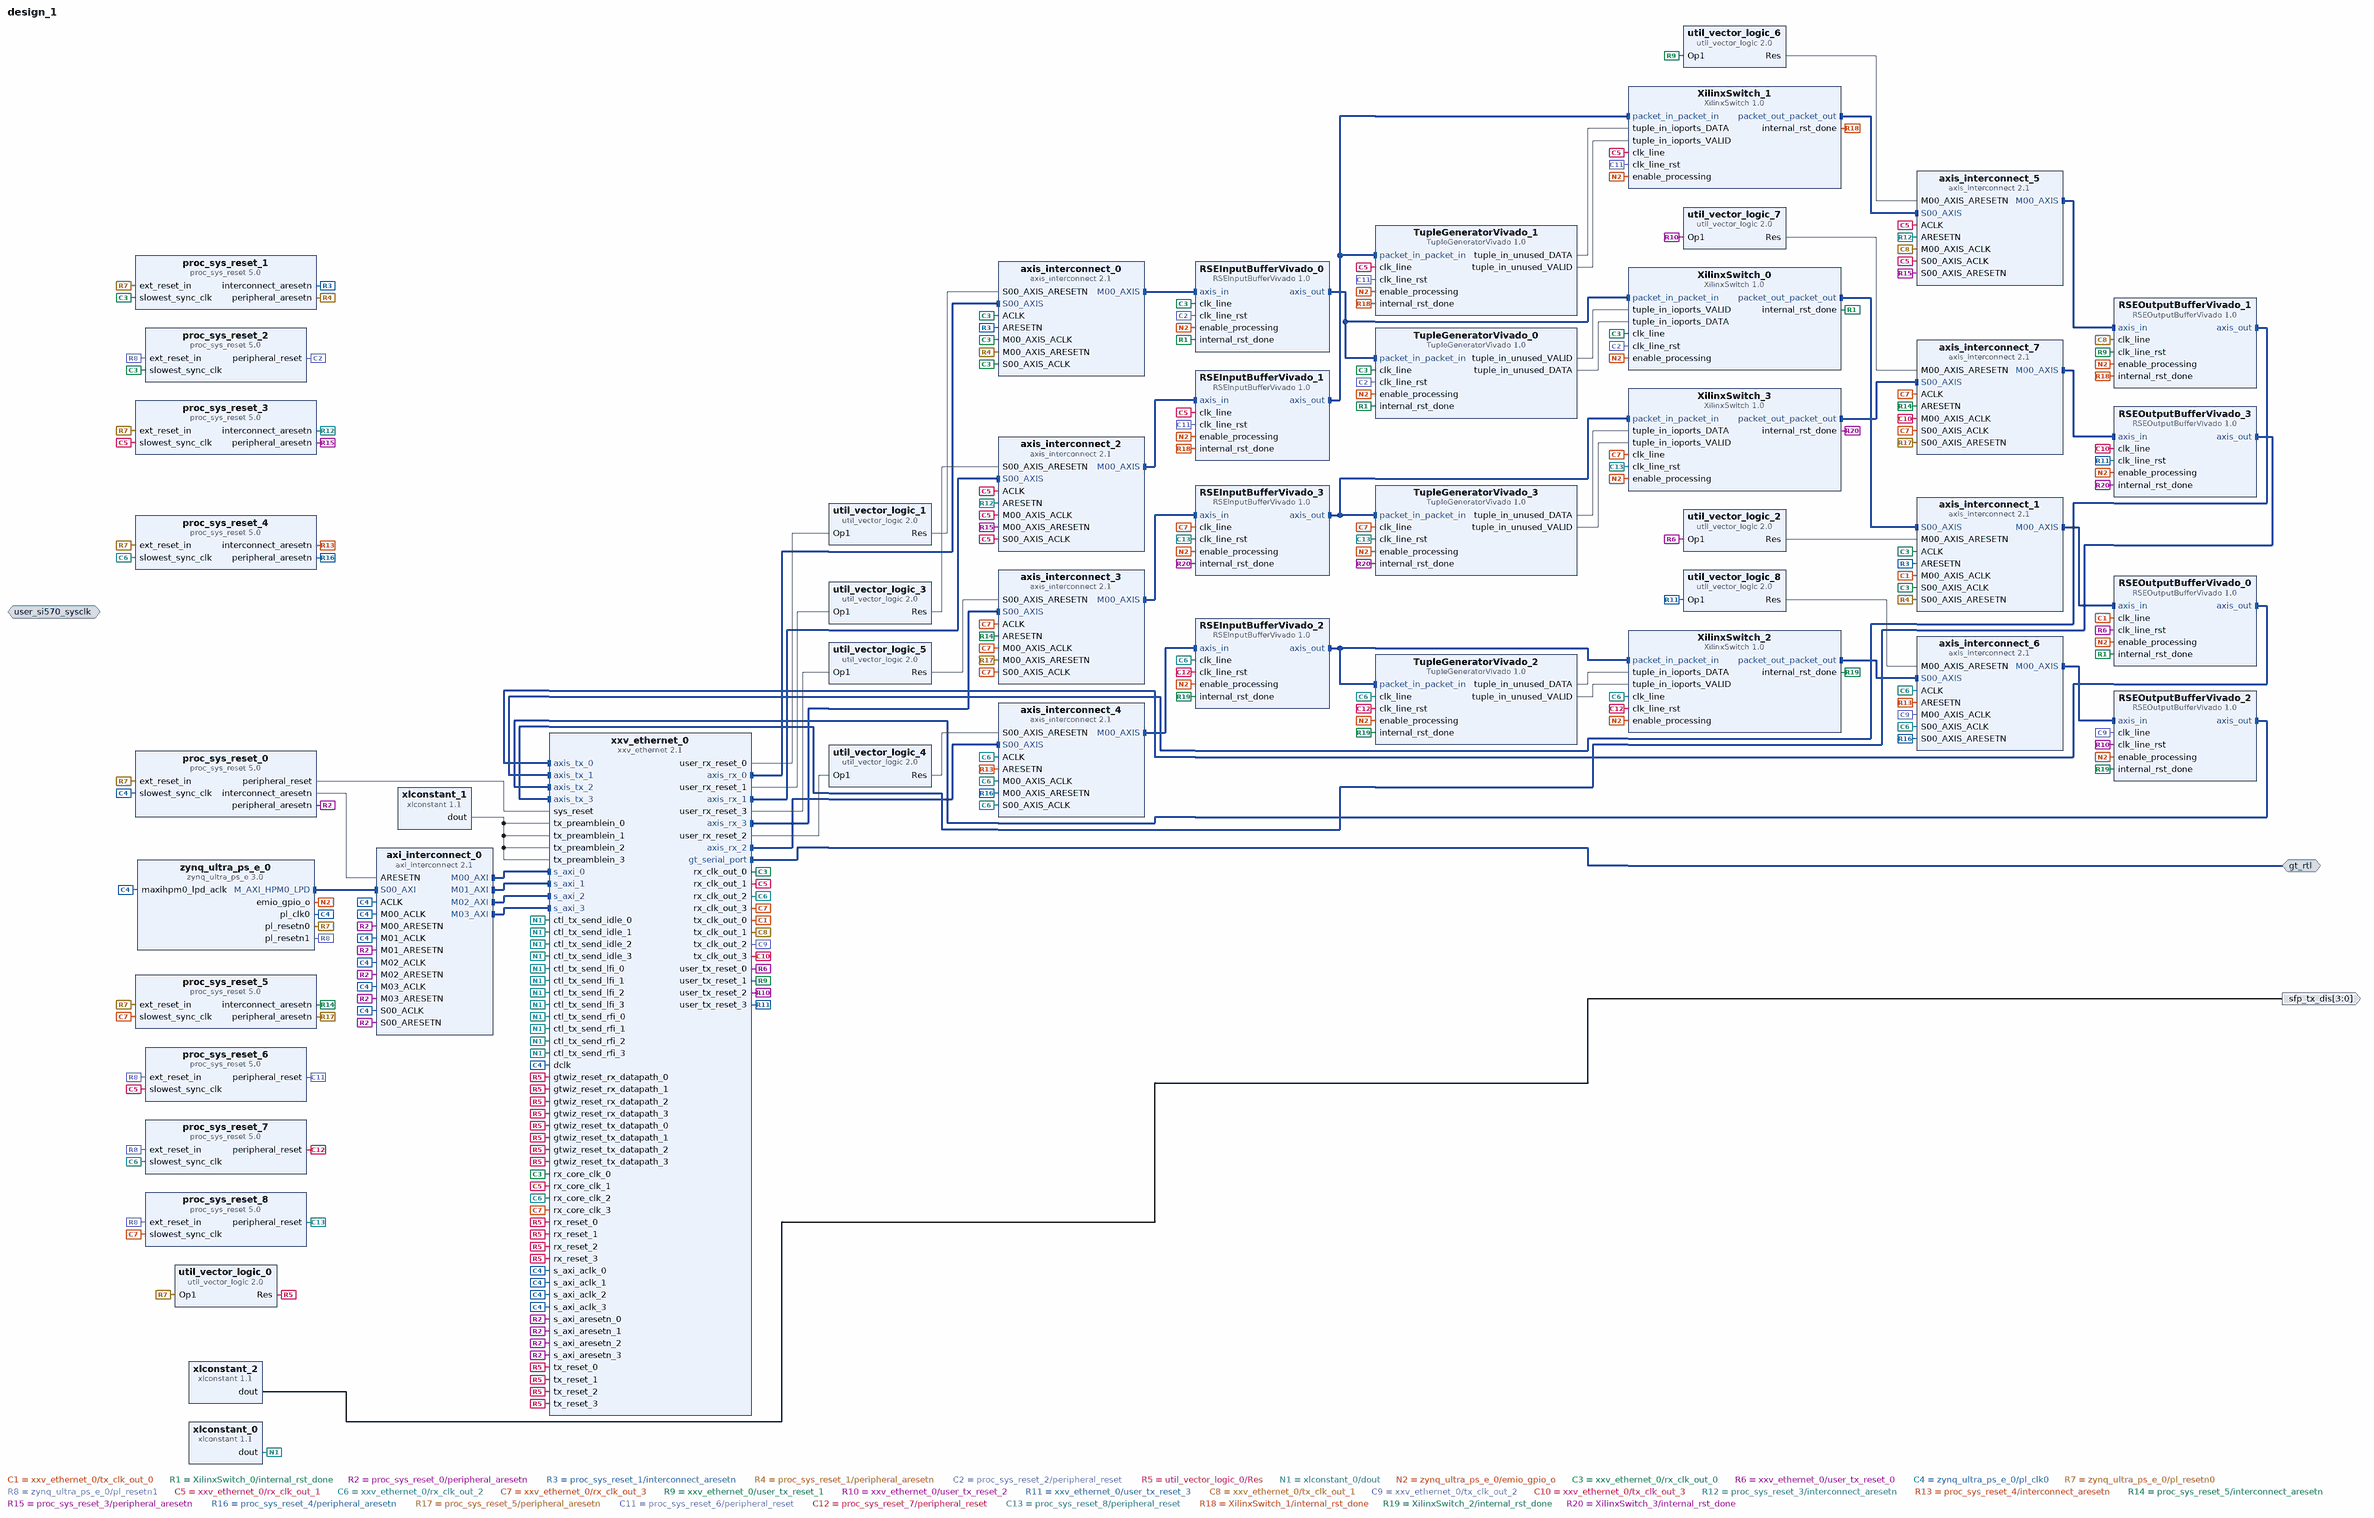
[diagram p0: block diagram of the top level]
# Vivado block design design_1, xczu9eg-ffvb1156-2-i, Vivado 2017.1_sdx
create_bd_design design_1

create_bd_intf_port -mode Master -vlnv xilinx.com:interface:gt_rtl:1.0 gt_rtl
create_bd_intf_port -mode Slave -vlnv xilinx.com:interface:diff_clock_rtl:1.0 user_si570_sysclk
set_property -dict {CONFIG.FREQ_HZ 156250000} [get_bd_intf_ports user_si570_sysclk]
create_bd_port -dir O -from 3 -to 0 sfp_tx_dis

create_bd_cell -type ip -vlnv xilinx.com:ip:axi_interconnect:2.1 axi_interconnect_0
set_property -dict {CONFIG.NUM_MI 4} [get_bd_cells axi_interconnect_0]
create_bd_cell -type ip -vlnv xilinx.com:ip:axis_interconnect:2.1 axis_interconnect_0
set_property -dict {CONFIG.NUM_MI 1} [get_bd_cells axis_interconnect_0]
create_bd_cell -type ip -vlnv xilinx.com:ip:axis_interconnect:2.1 axis_interconnect_1
set_property -dict {CONFIG.NUM_MI 1} [get_bd_cells axis_interconnect_1]
create_bd_cell -type ip -vlnv xilinx.com:ip:proc_sys_reset:5.0 proc_sys_reset_0
create_bd_cell -type ip -vlnv xilinx.com:ip:proc_sys_reset:5.0 proc_sys_reset_1
create_bd_cell -type ip -vlnv xilinx.com:ip:proc_sys_reset:5.0 proc_sys_reset_2
create_bd_cell -type ip -vlnv xilinx.com:ip:util_vector_logic:2.0 util_vector_logic_0
set_property -dict {CONFIG.C_SIZE 1 CONFIG.C_OPERATION not} [get_bd_cells util_vector_logic_0]
create_bd_cell -type ip -vlnv xilinx.com:ip:util_vector_logic:2.0 util_vector_logic_1
set_property -dict {CONFIG.C_SIZE 1 CONFIG.C_OPERATION not} [get_bd_cells util_vector_logic_1]
create_bd_cell -type ip -vlnv xilinx.com:ip:util_vector_logic:2.0 util_vector_logic_2
set_property -dict {CONFIG.C_SIZE 1 CONFIG.C_OPERATION not} [get_bd_cells util_vector_logic_2]
create_bd_cell -type ip -vlnv xilinx.com:ip:xlconstant:1.1 xlconstant_0
set_property -dict {CONFIG.CONST_WIDTH 1 CONFIG.CONST_VAL 0} [get_bd_cells xlconstant_0]
create_bd_cell -type ip -vlnv xilinx.com:ip:xlconstant:1.1 xlconstant_1
set_property -dict {CONFIG.CONST_WIDTH 56 CONFIG.CONST_VAL 0} [get_bd_cells xlconstant_1]
create_bd_cell -type ip -vlnv xilinx.com:ip:xlconstant:1.1 xlconstant_2
set_property -dict {CONFIG.CONST_WIDTH 4 CONFIG.CONST_VAL 0} [get_bd_cells xlconstant_2]
create_bd_cell -type ip -vlnv xilinx.com:ip:xxv_ethernet:2.1 xxv_ethernet_0
set_property -dict [list \
  CONFIG.NUM_OF_CORES 4 \
  CONFIG.BASE_R_KR BASE-R \
  CONFIG.GT_GROUP_SELECT Quad_X1Y3 \
  CONFIG.LANE1_GT_LOC X1Y12 \
  CONFIG.LANE2_GT_LOC X1Y13 \
  CONFIG.LANE3_GT_LOC X1Y14 \
  CONFIG.LANE4_GT_LOC X1Y15 \
  CONFIG.USE_BOARD_FLOW true \
  CONFIG.DIFFCLK_BOARD_INTERFACE user_si570_sysclk \
] [get_bd_cells xxv_ethernet_0]
create_bd_cell -type ip -vlnv xilinx.com:ip:zynq_ultra_ps_e:3.0 zynq_ultra_ps_e_0
set_property -dict [list \
  CONFIG.PSU__FPGA_PL1_ENABLE 1 \
  CONFIG.PSU__GPIO_EMIO__PERIPHERAL__ENABLE 1 \
  CONFIG.PSU__GPIO_EMIO__PERIPHERAL__IO 1 \
  CONFIG.PSU__PMU__PERIPHERAL__ENABLE 0 \
  CONFIG.PSU__CRL_APB__PL0_REF_CTRL__SRCSEL IOPLL \
  CONFIG.PSU__CRL_APB__PL1_REF_CTRL__SRCSEL IOPLL \
  CONFIG.PSU__CRL_APB__PL1_REF_CTRL__FREQMHZ 300 \
  CONFIG.PSU__NUM_FABRIC_RESETS 2 \
] [get_bd_cells zynq_ultra_ps_e_0]
create_bd_cell -type ip -vlnv upenn.edu:user:RSEInputBufferVivado:1.0 RSEInputBufferVivado_0
create_bd_cell -type ip -vlnv upenn.edu:user:TupleGeneratorVivado:1.0 TupleGeneratorVivado_0
create_bd_cell -type ip -vlnv upenn.edu:user:RSEOutputBufferVivado:1.0 RSEOutputBufferVivado_0
create_bd_cell -type ip -vlnv xilinx.com:sdnet:XilinxSwitch:1.0 XilinxSwitch_0
create_bd_cell -type ip -vlnv upenn.edu:user:RSEOutputBufferVivado:1.0 RSEOutputBufferVivado_1
create_bd_cell -type ip -vlnv upenn.edu:user:RSEOutputBufferVivado:1.0 RSEOutputBufferVivado_2
create_bd_cell -type ip -vlnv upenn.edu:user:RSEOutputBufferVivado:1.0 RSEOutputBufferVivado_3
create_bd_cell -type ip -vlnv xilinx.com:ip:util_vector_logic:2.0 util_vector_logic_3
set_property -dict {CONFIG.C_SIZE 1 CONFIG.C_OPERATION not} [get_bd_cells util_vector_logic_3]
create_bd_cell -type ip -vlnv xilinx.com:ip:util_vector_logic:2.0 util_vector_logic_4
set_property -dict {CONFIG.C_SIZE 1 CONFIG.C_OPERATION not} [get_bd_cells util_vector_logic_4]
create_bd_cell -type ip -vlnv xilinx.com:ip:util_vector_logic:2.0 util_vector_logic_5
set_property -dict {CONFIG.C_SIZE 1 CONFIG.C_OPERATION not} [get_bd_cells util_vector_logic_5]
create_bd_cell -type ip -vlnv xilinx.com:ip:axis_interconnect:2.1 axis_interconnect_2
set_property -dict {CONFIG.NUM_MI 1} [get_bd_cells axis_interconnect_2]
create_bd_cell -type ip -vlnv xilinx.com:ip:axis_interconnect:2.1 axis_interconnect_3
set_property -dict {CONFIG.NUM_MI 1} [get_bd_cells axis_interconnect_3]
create_bd_cell -type ip -vlnv xilinx.com:ip:axis_interconnect:2.1 axis_interconnect_4
set_property -dict {CONFIG.NUM_MI 1} [get_bd_cells axis_interconnect_4]
create_bd_cell -type ip -vlnv upenn.edu:user:RSEInputBufferVivado:1.0 RSEInputBufferVivado_1
create_bd_cell -type ip -vlnv upenn.edu:user:RSEInputBufferVivado:1.0 RSEInputBufferVivado_2
create_bd_cell -type ip -vlnv upenn.edu:user:RSEInputBufferVivado:1.0 RSEInputBufferVivado_3
create_bd_cell -type ip -vlnv upenn.edu:user:TupleGeneratorVivado:1.0 TupleGeneratorVivado_1
create_bd_cell -type ip -vlnv upenn.edu:user:TupleGeneratorVivado:1.0 TupleGeneratorVivado_2
create_bd_cell -type ip -vlnv upenn.edu:user:TupleGeneratorVivado:1.0 TupleGeneratorVivado_3
create_bd_cell -type ip -vlnv xilinx.com:sdnet:XilinxSwitch:1.0 XilinxSwitch_1
create_bd_cell -type ip -vlnv xilinx.com:sdnet:XilinxSwitch:1.0 XilinxSwitch_2
create_bd_cell -type ip -vlnv xilinx.com:sdnet:XilinxSwitch:1.0 XilinxSwitch_3
create_bd_cell -type ip -vlnv xilinx.com:ip:axis_interconnect:2.1 axis_interconnect_5
set_property -dict {CONFIG.NUM_MI 1} [get_bd_cells axis_interconnect_5]
create_bd_cell -type ip -vlnv xilinx.com:ip:axis_interconnect:2.1 axis_interconnect_6
set_property -dict {CONFIG.NUM_MI 1} [get_bd_cells axis_interconnect_6]
create_bd_cell -type ip -vlnv xilinx.com:ip:axis_interconnect:2.1 axis_interconnect_7
set_property -dict {CONFIG.NUM_MI 1} [get_bd_cells axis_interconnect_7]
create_bd_cell -type ip -vlnv xilinx.com:ip:proc_sys_reset:5.0 proc_sys_reset_3
create_bd_cell -type ip -vlnv xilinx.com:ip:proc_sys_reset:5.0 proc_sys_reset_4
create_bd_cell -type ip -vlnv xilinx.com:ip:proc_sys_reset:5.0 proc_sys_reset_5
create_bd_cell -type ip -vlnv xilinx.com:ip:proc_sys_reset:5.0 proc_sys_reset_6
create_bd_cell -type ip -vlnv xilinx.com:ip:proc_sys_reset:5.0 proc_sys_reset_7
create_bd_cell -type ip -vlnv xilinx.com:ip:proc_sys_reset:5.0 proc_sys_reset_8
create_bd_cell -type ip -vlnv xilinx.com:ip:util_vector_logic:2.0 util_vector_logic_6
set_property -dict {CONFIG.C_SIZE 1 CONFIG.C_OPERATION not} [get_bd_cells util_vector_logic_6]
create_bd_cell -type ip -vlnv xilinx.com:ip:util_vector_logic:2.0 util_vector_logic_7
set_property -dict {CONFIG.C_SIZE 1 CONFIG.C_OPERATION not} [get_bd_cells util_vector_logic_7]
create_bd_cell -type ip -vlnv xilinx.com:ip:util_vector_logic:2.0 util_vector_logic_8
set_property -dict {CONFIG.C_SIZE 1 CONFIG.C_OPERATION not} [get_bd_cells util_vector_logic_8]

# ---- connections ----

connect_bd_intf_net [get_bd_intf_pins axis_interconnect_0/S00_AXIS] [get_bd_intf_pins xxv_ethernet_0/axis_rx_0]
connect_bd_intf_net [get_bd_intf_pins axi_interconnect_0/M00_AXI] [get_bd_intf_pins xxv_ethernet_0/s_axi_0]
connect_bd_intf_net [get_bd_intf_pins RSEInputBufferVivado_0/axis_in] [get_bd_intf_pins axis_interconnect_0/M00_AXIS]
connect_bd_intf_net [get_bd_intf_pins axi_interconnect_0/S00_AXI] [get_bd_intf_pins zynq_ultra_ps_e_0/M_AXI_HPM0_LPD]
connect_bd_intf_net [get_bd_intf_pins RSEInputBufferVivado_0/axis_out] [get_bd_intf_pins XilinxSwitch_0/packet_in_packet_in]
connect_bd_intf_net [get_bd_intf_pins RSEInputBufferVivado_0/axis_out] [get_bd_intf_pins TupleGeneratorVivado_0/packet_in_packet_in]
connect_bd_intf_net [get_bd_intf_pins XilinxSwitch_0/packet_out_packet_out] [get_bd_intf_pins axis_interconnect_1/S00_AXIS]
connect_bd_intf_net [get_bd_intf_pins axis_interconnect_1/M00_AXIS] [get_bd_intf_pins RSEOutputBufferVivado_0/axis_in]
connect_bd_intf_net [get_bd_intf_pins axi_interconnect_0/M01_AXI] [get_bd_intf_pins xxv_ethernet_0/s_axi_1]
connect_bd_intf_net [get_bd_intf_pins axi_interconnect_0/M02_AXI] [get_bd_intf_pins xxv_ethernet_0/s_axi_2]
connect_bd_intf_net [get_bd_intf_pins axi_interconnect_0/M03_AXI] [get_bd_intf_pins xxv_ethernet_0/s_axi_3]
connect_bd_intf_net [get_bd_intf_pins RSEOutputBufferVivado_0/axis_out] [get_bd_intf_pins xxv_ethernet_0/axis_tx_0]
connect_bd_intf_net [get_bd_intf_pins RSEOutputBufferVivado_1/axis_out] [get_bd_intf_pins xxv_ethernet_0/axis_tx_1]
connect_bd_intf_net [get_bd_intf_pins RSEOutputBufferVivado_2/axis_out] [get_bd_intf_pins xxv_ethernet_0/axis_tx_2]
connect_bd_intf_net [get_bd_intf_pins xxv_ethernet_0/axis_tx_3] [get_bd_intf_pins RSEOutputBufferVivado_3/axis_out]
connect_bd_intf_net [get_bd_intf_pins RSEInputBufferVivado_1/axis_in] [get_bd_intf_pins axis_interconnect_2/M00_AXIS]
connect_bd_intf_net [get_bd_intf_pins RSEInputBufferVivado_2/axis_in] [get_bd_intf_pins axis_interconnect_4/M00_AXIS]
connect_bd_intf_net [get_bd_intf_pins axis_interconnect_3/M00_AXIS] [get_bd_intf_pins RSEInputBufferVivado_3/axis_in]
connect_bd_intf_net [get_bd_intf_pins XilinxSwitch_1/packet_out_packet_out] [get_bd_intf_pins axis_interconnect_5/S00_AXIS]
connect_bd_intf_net [get_bd_intf_pins XilinxSwitch_2/packet_out_packet_out] [get_bd_intf_pins axis_interconnect_6/S00_AXIS]
connect_bd_intf_net [get_bd_intf_pins XilinxSwitch_3/packet_out_packet_out] [get_bd_intf_pins axis_interconnect_7/S00_AXIS]
connect_bd_intf_net [get_bd_intf_pins RSEOutputBufferVivado_1/axis_in] [get_bd_intf_pins axis_interconnect_5/M00_AXIS]
connect_bd_intf_net [get_bd_intf_pins RSEOutputBufferVivado_2/axis_in] [get_bd_intf_pins axis_interconnect_6/M00_AXIS]
connect_bd_intf_net [get_bd_intf_pins RSEOutputBufferVivado_3/axis_in] [get_bd_intf_pins axis_interconnect_7/M00_AXIS]
connect_bd_intf_net [get_bd_intf_pins xxv_ethernet_0/axis_rx_1] [get_bd_intf_pins axis_interconnect_2/S00_AXIS]
connect_bd_intf_net [get_bd_intf_pins axis_interconnect_4/S00_AXIS] [get_bd_intf_pins xxv_ethernet_0/axis_rx_2]
connect_bd_intf_net [get_bd_intf_pins xxv_ethernet_0/axis_rx_3] [get_bd_intf_pins axis_interconnect_3/S00_AXIS]
connect_bd_intf_net [get_bd_intf_pins RSEInputBufferVivado_1/axis_out] [get_bd_intf_pins XilinxSwitch_1/packet_in_packet_in]
connect_bd_intf_net [get_bd_intf_pins RSEInputBufferVivado_1/axis_out] [get_bd_intf_pins TupleGeneratorVivado_1/packet_in_packet_in]
connect_bd_intf_net [get_bd_intf_pins RSEInputBufferVivado_2/axis_out] [get_bd_intf_pins XilinxSwitch_2/packet_in_packet_in]
connect_bd_intf_net [get_bd_intf_pins RSEInputBufferVivado_2/axis_out] [get_bd_intf_pins TupleGeneratorVivado_2/packet_in_packet_in]
connect_bd_intf_net [get_bd_intf_pins RSEInputBufferVivado_3/axis_out] [get_bd_intf_pins XilinxSwitch_3/packet_in_packet_in]
connect_bd_intf_net [get_bd_intf_pins RSEInputBufferVivado_3/axis_out] [get_bd_intf_pins TupleGeneratorVivado_3/packet_in_packet_in]
connect_bd_intf_net [get_bd_intf_ports gt_rtl] [get_bd_intf_pins xxv_ethernet_0/gt_serial_port]
connect_bd_net -net ARESETN_1 [get_bd_pins proc_sys_reset_0/interconnect_aresetn] [get_bd_pins axi_interconnect_0/ARESETN]
connect_bd_net -net M00_AXIS_ACLK_2 [get_bd_pins xxv_ethernet_0/tx_clk_out_0] \
  [get_bd_pins RSEOutputBufferVivado_0/clk_line] [get_bd_pins axis_interconnect_1/M00_AXIS_ACLK]
connect_bd_net -net M00_AXIS_ARESETN_1 [get_bd_pins util_vector_logic_2/Res] [get_bd_pins axis_interconnect_1/M00_AXIS_ARESETN]
connect_bd_net [get_bd_pins XilinxSwitch_0/internal_rst_done] \
  [get_bd_pins RSEInputBufferVivado_0/internal_rst_done] [get_bd_pins TupleGeneratorVivado_0/internal_rst_done] \
  [get_bd_pins RSEOutputBufferVivado_0/internal_rst_done]
connect_bd_net [get_bd_pins proc_sys_reset_0/peripheral_aresetn] \
  [get_bd_pins xxv_ethernet_0/s_axi_aresetn_0] [get_bd_pins xxv_ethernet_0/s_axi_aresetn_1] \
  [get_bd_pins xxv_ethernet_0/s_axi_aresetn_2] [get_bd_pins xxv_ethernet_0/s_axi_aresetn_3] \
  [get_bd_pins axi_interconnect_0/M00_ARESETN] [get_bd_pins axi_interconnect_0/S00_ARESETN] \
  [get_bd_pins axi_interconnect_0/M01_ARESETN] [get_bd_pins axi_interconnect_0/M02_ARESETN] \
  [get_bd_pins axi_interconnect_0/M03_ARESETN]
connect_bd_net [get_bd_pins proc_sys_reset_0/peripheral_reset] [get_bd_pins xxv_ethernet_0/sys_reset]
connect_bd_net [get_bd_pins proc_sys_reset_1/interconnect_aresetn] [get_bd_pins axis_interconnect_0/ARESETN] [get_bd_pins axis_interconnect_1/ARESETN]
connect_bd_net [get_bd_pins proc_sys_reset_1/peripheral_aresetn] \
  [get_bd_pins axis_interconnect_0/M00_AXIS_ARESETN] [get_bd_pins axis_interconnect_1/S00_AXIS_ARESETN]
connect_bd_net [get_bd_pins proc_sys_reset_2/peripheral_reset] \
  [get_bd_pins RSEInputBufferVivado_0/clk_line_rst] [get_bd_pins TupleGeneratorVivado_0/clk_line_rst] \
  [get_bd_pins XilinxSwitch_0/clk_line_rst]
connect_bd_net [get_bd_pins util_vector_logic_0/Res] \
  [get_bd_pins xxv_ethernet_0/gtwiz_reset_rx_datapath_0] [get_bd_pins xxv_ethernet_0/gtwiz_reset_tx_datapath_0] \
  [get_bd_pins xxv_ethernet_0/rx_reset_0] [get_bd_pins xxv_ethernet_0/tx_reset_0] \
  [get_bd_pins xxv_ethernet_0/gtwiz_reset_tx_datapath_1] [get_bd_pins xxv_ethernet_0/gtwiz_reset_rx_datapath_1] \
  [get_bd_pins xxv_ethernet_0/rx_reset_1] [get_bd_pins xxv_ethernet_0/tx_reset_1] \
  [get_bd_pins xxv_ethernet_0/gtwiz_reset_tx_datapath_2] [get_bd_pins xxv_ethernet_0/gtwiz_reset_tx_datapath_3] \
  [get_bd_pins xxv_ethernet_0/gtwiz_reset_rx_datapath_2] [get_bd_pins xxv_ethernet_0/gtwiz_reset_rx_datapath_3] \
  [get_bd_pins xxv_ethernet_0/rx_reset_2] [get_bd_pins xxv_ethernet_0/rx_reset_3] [get_bd_pins xxv_ethernet_0/tx_reset_2] \
  [get_bd_pins xxv_ethernet_0/tx_reset_3]
connect_bd_net [get_bd_pins util_vector_logic_1/Res] [get_bd_pins axis_interconnect_0/S00_AXIS_ARESETN]
connect_bd_net [get_bd_pins xlconstant_0/dout] \
  [get_bd_pins xxv_ethernet_0/ctl_tx_send_idle_0] [get_bd_pins xxv_ethernet_0/ctl_tx_send_lfi_0] \
  [get_bd_pins xxv_ethernet_0/ctl_tx_send_rfi_0] [get_bd_pins xxv_ethernet_0/ctl_tx_send_idle_1] \
  [get_bd_pins xxv_ethernet_0/ctl_tx_send_lfi_1] [get_bd_pins xxv_ethernet_0/ctl_tx_send_rfi_1] \
  [get_bd_pins xxv_ethernet_0/ctl_tx_send_idle_2] [get_bd_pins xxv_ethernet_0/ctl_tx_send_lfi_2] \
  [get_bd_pins xxv_ethernet_0/ctl_tx_send_rfi_2] [get_bd_pins xxv_ethernet_0/ctl_tx_send_idle_3] \
  [get_bd_pins xxv_ethernet_0/ctl_tx_send_lfi_3] [get_bd_pins xxv_ethernet_0/ctl_tx_send_rfi_3]
connect_bd_net [get_bd_pins xlconstant_1/dout] \
  [get_bd_pins xxv_ethernet_0/tx_preamblein_0] [get_bd_pins xxv_ethernet_0/tx_preamblein_1] \
  [get_bd_pins xxv_ethernet_0/tx_preamblein_2] [get_bd_pins xxv_ethernet_0/tx_preamblein_3]
connect_bd_net -net xlconstant_3_dout [get_bd_pins zynq_ultra_ps_e_0/emio_gpio_o] \
  [get_bd_pins RSEInputBufferVivado_0/enable_processing] [get_bd_pins TupleGeneratorVivado_0/enable_processing] \
  [get_bd_pins RSEOutputBufferVivado_0/enable_processing] [get_bd_pins XilinxSwitch_0/enable_processing] \
  [get_bd_pins TupleGeneratorVivado_1/enable_processing] [get_bd_pins TupleGeneratorVivado_2/enable_processing] \
  [get_bd_pins TupleGeneratorVivado_3/enable_processing] [get_bd_pins RSEInputBufferVivado_3/enable_processing] \
  [get_bd_pins RSEInputBufferVivado_2/enable_processing] [get_bd_pins RSEInputBufferVivado_1/enable_processing] \
  [get_bd_pins XilinxSwitch_3/enable_processing] [get_bd_pins XilinxSwitch_2/enable_processing] \
  [get_bd_pins XilinxSwitch_1/enable_processing] [get_bd_pins RSEOutputBufferVivado_1/enable_processing] \
  [get_bd_pins RSEOutputBufferVivado_2/enable_processing] [get_bd_pins RSEOutputBufferVivado_3/enable_processing]
connect_bd_net [get_bd_pins xxv_ethernet_0/rx_clk_out_0] \
  [get_bd_pins xxv_ethernet_0/rx_core_clk_0] [get_bd_pins proc_sys_reset_1/slowest_sync_clk] \
  [get_bd_pins proc_sys_reset_2/slowest_sync_clk] [get_bd_pins RSEInputBufferVivado_0/clk_line] \
  [get_bd_pins TupleGeneratorVivado_0/clk_line] [get_bd_pins XilinxSwitch_0/clk_line] \
  [get_bd_pins axis_interconnect_0/S00_AXIS_ACLK] [get_bd_pins axis_interconnect_0/ACLK] \
  [get_bd_pins axis_interconnect_0/M00_AXIS_ACLK] [get_bd_pins axis_interconnect_1/ACLK] \
  [get_bd_pins axis_interconnect_1/S00_AXIS_ACLK]
connect_bd_net [get_bd_pins xxv_ethernet_0/user_rx_reset_0] [get_bd_pins util_vector_logic_1/Op1]
connect_bd_net [get_bd_pins xxv_ethernet_0/user_tx_reset_0] [get_bd_pins util_vector_logic_2/Op1] [get_bd_pins RSEOutputBufferVivado_0/clk_line_rst]
connect_bd_net [get_bd_pins zynq_ultra_ps_e_0/pl_clk0] \
  [get_bd_pins proc_sys_reset_0/slowest_sync_clk] [get_bd_pins xxv_ethernet_0/dclk] [get_bd_pins xxv_ethernet_0/s_axi_aclk_0] \
  [get_bd_pins zynq_ultra_ps_e_0/maxihpm0_lpd_aclk] [get_bd_pins xxv_ethernet_0/s_axi_aclk_1] \
  [get_bd_pins xxv_ethernet_0/s_axi_aclk_2] [get_bd_pins xxv_ethernet_0/s_axi_aclk_3] [get_bd_pins axi_interconnect_0/ACLK] \
  [get_bd_pins axi_interconnect_0/M00_ACLK] [get_bd_pins axi_interconnect_0/S00_ACLK] \
  [get_bd_pins axi_interconnect_0/M01_ACLK] [get_bd_pins axi_interconnect_0/M02_ACLK] \
  [get_bd_pins axi_interconnect_0/M03_ACLK]
connect_bd_net [get_bd_pins zynq_ultra_ps_e_0/pl_resetn0] \
  [get_bd_pins proc_sys_reset_0/ext_reset_in] [get_bd_pins proc_sys_reset_1/ext_reset_in] \
  [get_bd_pins util_vector_logic_0/Op1] [get_bd_pins proc_sys_reset_5/ext_reset_in] \
  [get_bd_pins proc_sys_reset_4/ext_reset_in] [get_bd_pins proc_sys_reset_3/ext_reset_in]
connect_bd_net [get_bd_pins zynq_ultra_ps_e_0/pl_resetn1] \
  [get_bd_pins proc_sys_reset_2/ext_reset_in] [get_bd_pins proc_sys_reset_8/ext_reset_in] \
  [get_bd_pins proc_sys_reset_7/ext_reset_in] [get_bd_pins proc_sys_reset_6/ext_reset_in]
connect_bd_net [get_bd_pins TupleGeneratorVivado_0/tuple_in_unused_VALID] [get_bd_pins XilinxSwitch_0/tuple_in_ioports_VALID]
connect_bd_net [get_bd_pins TupleGeneratorVivado_0/tuple_in_unused_DATA] [get_bd_pins XilinxSwitch_0/tuple_in_ioports_DATA]
connect_bd_net [get_bd_pins xxv_ethernet_0/rx_clk_out_1] \
  [get_bd_pins xxv_ethernet_0/rx_core_clk_1] [get_bd_pins RSEInputBufferVivado_1/clk_line] \
  [get_bd_pins axis_interconnect_2/ACLK] [get_bd_pins axis_interconnect_2/S00_AXIS_ACLK] \
  [get_bd_pins axis_interconnect_2/M00_AXIS_ACLK] [get_bd_pins TupleGeneratorVivado_1/clk_line] \
  [get_bd_pins XilinxSwitch_1/clk_line] [get_bd_pins axis_interconnect_5/ACLK] \
  [get_bd_pins axis_interconnect_5/S00_AXIS_ACLK] [get_bd_pins proc_sys_reset_3/slowest_sync_clk] \
  [get_bd_pins proc_sys_reset_6/slowest_sync_clk]
connect_bd_net [get_bd_pins xlconstant_2/dout] [get_bd_ports sfp_tx_dis]
connect_bd_net [get_bd_pins xxv_ethernet_0/rx_clk_out_2] \
  [get_bd_pins xxv_ethernet_0/rx_core_clk_2] [get_bd_pins RSEInputBufferVivado_2/clk_line] \
  [get_bd_pins axis_interconnect_4/ACLK] [get_bd_pins axis_interconnect_4/S00_AXIS_ACLK] \
  [get_bd_pins axis_interconnect_4/M00_AXIS_ACLK] [get_bd_pins TupleGeneratorVivado_2/clk_line] \
  [get_bd_pins XilinxSwitch_2/clk_line] [get_bd_pins axis_interconnect_6/ACLK] \
  [get_bd_pins axis_interconnect_6/S00_AXIS_ACLK] [get_bd_pins proc_sys_reset_4/slowest_sync_clk] \
  [get_bd_pins proc_sys_reset_7/slowest_sync_clk]
connect_bd_net [get_bd_pins xxv_ethernet_0/rx_clk_out_3] \
  [get_bd_pins xxv_ethernet_0/rx_core_clk_3] [get_bd_pins RSEInputBufferVivado_3/clk_line] \
  [get_bd_pins axis_interconnect_3/ACLK] [get_bd_pins axis_interconnect_3/S00_AXIS_ACLK] \
  [get_bd_pins axis_interconnect_3/M00_AXIS_ACLK] [get_bd_pins TupleGeneratorVivado_3/clk_line] \
  [get_bd_pins XilinxSwitch_3/clk_line] [get_bd_pins axis_interconnect_7/ACLK] \
  [get_bd_pins axis_interconnect_7/S00_AXIS_ACLK] [get_bd_pins proc_sys_reset_5/slowest_sync_clk] \
  [get_bd_pins proc_sys_reset_8/slowest_sync_clk]
connect_bd_net [get_bd_pins xxv_ethernet_0/user_tx_reset_1] [get_bd_pins RSEOutputBufferVivado_1/clk_line_rst] [get_bd_pins util_vector_logic_6/Op1]
connect_bd_net [get_bd_pins xxv_ethernet_0/user_tx_reset_2] [get_bd_pins RSEOutputBufferVivado_2/clk_line_rst] [get_bd_pins util_vector_logic_7/Op1]
connect_bd_net [get_bd_pins xxv_ethernet_0/user_tx_reset_3] [get_bd_pins RSEOutputBufferVivado_3/clk_line_rst] [get_bd_pins util_vector_logic_8/Op1]
connect_bd_net [get_bd_pins xxv_ethernet_0/user_rx_reset_1] [get_bd_pins util_vector_logic_3/Op1]
connect_bd_net [get_bd_pins xxv_ethernet_0/user_rx_reset_2] [get_bd_pins util_vector_logic_4/Op1]
connect_bd_net [get_bd_pins xxv_ethernet_0/user_rx_reset_3] [get_bd_pins util_vector_logic_5/Op1]
connect_bd_net [get_bd_pins xxv_ethernet_0/tx_clk_out_1] \
  [get_bd_pins RSEOutputBufferVivado_1/clk_line] [get_bd_pins axis_interconnect_5/M00_AXIS_ACLK]
connect_bd_net [get_bd_pins xxv_ethernet_0/tx_clk_out_2] \
  [get_bd_pins RSEOutputBufferVivado_2/clk_line] [get_bd_pins axis_interconnect_6/M00_AXIS_ACLK]
connect_bd_net [get_bd_pins xxv_ethernet_0/tx_clk_out_3] \
  [get_bd_pins RSEOutputBufferVivado_3/clk_line] [get_bd_pins axis_interconnect_7/M00_AXIS_ACLK]
connect_bd_net [get_bd_pins util_vector_logic_3/Res] [get_bd_pins axis_interconnect_2/S00_AXIS_ARESETN]
connect_bd_net [get_bd_pins util_vector_logic_4/Res] [get_bd_pins axis_interconnect_4/S00_AXIS_ARESETN]
connect_bd_net -net S00_AXIS_ARESETN_1 [get_bd_pins util_vector_logic_5/Res] [get_bd_pins axis_interconnect_3/S00_AXIS_ARESETN]
connect_bd_net [get_bd_pins TupleGeneratorVivado_1/tuple_in_unused_DATA] [get_bd_pins XilinxSwitch_1/tuple_in_ioports_DATA]
connect_bd_net [get_bd_pins TupleGeneratorVivado_2/tuple_in_unused_DATA] [get_bd_pins XilinxSwitch_2/tuple_in_ioports_DATA]
connect_bd_net [get_bd_pins TupleGeneratorVivado_3/tuple_in_unused_DATA] [get_bd_pins XilinxSwitch_3/tuple_in_ioports_DATA]
connect_bd_net [get_bd_pins proc_sys_reset_3/interconnect_aresetn] [get_bd_pins axis_interconnect_2/ARESETN] [get_bd_pins axis_interconnect_5/ARESETN]
connect_bd_net [get_bd_pins proc_sys_reset_4/interconnect_aresetn] [get_bd_pins axis_interconnect_4/ARESETN] [get_bd_pins axis_interconnect_6/ARESETN]
connect_bd_net [get_bd_pins proc_sys_reset_5/interconnect_aresetn] [get_bd_pins axis_interconnect_3/ARESETN] [get_bd_pins axis_interconnect_7/ARESETN]
connect_bd_net -net M00_AXIS_ARESETN_2 [get_bd_pins proc_sys_reset_3/peripheral_aresetn] \
  [get_bd_pins axis_interconnect_2/M00_AXIS_ARESETN] [get_bd_pins axis_interconnect_5/S00_AXIS_ARESETN]
connect_bd_net -net M00_AXIS_ARESETN_3 [get_bd_pins proc_sys_reset_4/peripheral_aresetn] \
  [get_bd_pins axis_interconnect_4/M00_AXIS_ARESETN] [get_bd_pins axis_interconnect_6/S00_AXIS_ARESETN]
connect_bd_net -net M00_AXIS_ARESETN_4 [get_bd_pins proc_sys_reset_5/peripheral_aresetn] \
  [get_bd_pins axis_interconnect_3/M00_AXIS_ARESETN] [get_bd_pins axis_interconnect_7/S00_AXIS_ARESETN]
connect_bd_net [get_bd_pins proc_sys_reset_6/peripheral_reset] \
  [get_bd_pins RSEInputBufferVivado_1/clk_line_rst] [get_bd_pins TupleGeneratorVivado_1/clk_line_rst] \
  [get_bd_pins XilinxSwitch_1/clk_line_rst]
connect_bd_net [get_bd_pins proc_sys_reset_7/peripheral_reset] \
  [get_bd_pins RSEInputBufferVivado_2/clk_line_rst] [get_bd_pins TupleGeneratorVivado_2/clk_line_rst] \
  [get_bd_pins XilinxSwitch_2/clk_line_rst]
connect_bd_net [get_bd_pins proc_sys_reset_8/peripheral_reset] \
  [get_bd_pins RSEInputBufferVivado_3/clk_line_rst] [get_bd_pins TupleGeneratorVivado_3/clk_line_rst] \
  [get_bd_pins XilinxSwitch_3/clk_line_rst]
connect_bd_net [get_bd_pins XilinxSwitch_1/internal_rst_done] \
  [get_bd_pins RSEInputBufferVivado_1/internal_rst_done] [get_bd_pins TupleGeneratorVivado_1/internal_rst_done] \
  [get_bd_pins RSEOutputBufferVivado_1/internal_rst_done]
connect_bd_net [get_bd_pins XilinxSwitch_2/internal_rst_done] \
  [get_bd_pins RSEInputBufferVivado_2/internal_rst_done] [get_bd_pins TupleGeneratorVivado_2/internal_rst_done] \
  [get_bd_pins RSEOutputBufferVivado_2/internal_rst_done]
connect_bd_net [get_bd_pins XilinxSwitch_3/internal_rst_done] \
  [get_bd_pins RSEInputBufferVivado_3/internal_rst_done] [get_bd_pins TupleGeneratorVivado_3/internal_rst_done] \
  [get_bd_pins RSEOutputBufferVivado_3/internal_rst_done]
connect_bd_net [get_bd_pins TupleGeneratorVivado_1/tuple_in_unused_VALID] [get_bd_pins XilinxSwitch_1/tuple_in_ioports_VALID]
connect_bd_net [get_bd_pins TupleGeneratorVivado_2/tuple_in_unused_VALID] [get_bd_pins XilinxSwitch_2/tuple_in_ioports_VALID]
connect_bd_net [get_bd_pins TupleGeneratorVivado_3/tuple_in_unused_VALID] [get_bd_pins XilinxSwitch_3/tuple_in_ioports_VALID]
connect_bd_net [get_bd_pins util_vector_logic_6/Res] [get_bd_pins axis_interconnect_5/M00_AXIS_ARESETN]
connect_bd_net -net M00_AXIS_ARESETN_5 [get_bd_pins util_vector_logic_7/Res] [get_bd_pins axis_interconnect_7/M00_AXIS_ARESETN]
connect_bd_net [get_bd_pins util_vector_logic_8/Res] [get_bd_pins axis_interconnect_6/M00_AXIS_ARESETN]

# ---- address map ----
assign_bd_address -offset 0x00080000000 -range 64K -target_address_space [get_bd_addr_spaces zynq_ultra_ps_e_0/Data] [get_bd_addr_segs xxv_ethernet_0/s_axi_0/Reg]
assign_bd_address -offset 0x00080010000 -range 64K -target_address_space [get_bd_addr_spaces zynq_ultra_ps_e_0/Data] [get_bd_addr_segs xxv_ethernet_0/s_axi_1/Reg]
assign_bd_address -offset 0x00080020000 -range 64K -target_address_space [get_bd_addr_spaces zynq_ultra_ps_e_0/Data] [get_bd_addr_segs xxv_ethernet_0/s_axi_2/Reg]
assign_bd_address -offset 0x00080030000 -range 64K -target_address_space [get_bd_addr_spaces zynq_ultra_ps_e_0/Data] [get_bd_addr_segs xxv_ethernet_0/s_axi_3/Reg]

validate_bd_design
save_bd_design
